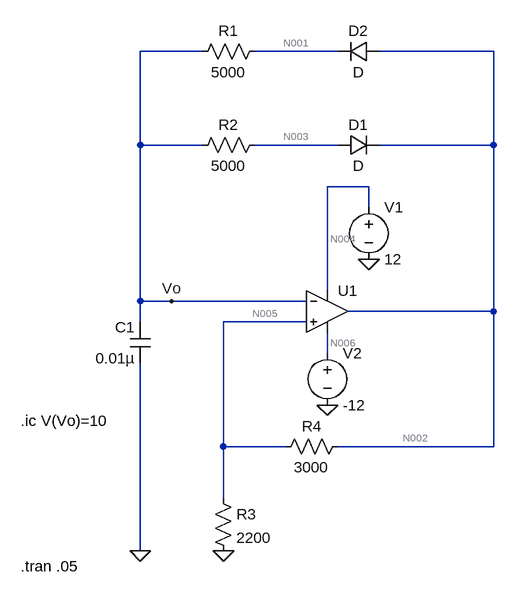
[diagram p0: schematic Draft1.asc]
Draft1.asc, the LTspice schematic file:
Version 4
SHEET 1 880 680
WIRE -16 -272 -112 -272
WIRE 192 -272 64 -272
WIRE 432 -272 256 -272
WIRE -112 -128 -112 -272
WIRE -16 -128 -112 -128
WIRE 192 -128 64 -128
WIRE 432 -128 432 -272
WIRE 432 -128 256 -128
WIRE 240 -64 176 -64
WIRE 240 -32 240 -64
WIRE 176 96 176 -64
WIRE -112 112 -112 -128
WIRE -64 112 -112 112
WIRE 144 112 -64 112
WIRE 432 128 432 -128
WIRE 432 128 208 128
WIRE -112 144 -112 112
WIRE 144 144 16 144
WIRE 176 192 176 160
WIRE 16 336 16 144
WIRE 112 336 16 336
WIRE 432 336 432 128
WIRE 432 336 192 336
WIRE 16 416 16 336
WIRE -112 496 -112 208
FLAG 176 272 0
FLAG 240 48 0
FLAG 16 496 0
FLAG -64 112 Vo
FLAG -112 496 0
SYMBOL Opamps\\UniversalOpamp2 176 128 R0
SYMATTR InstName U1
SYMBOL voltage 240 -48 R0
WINDOW 123 0 0 Left 2
WINDOW 39 0 0 Left 2
SYMATTR InstName V1
SYMATTR Value 12
SYMBOL voltage 176 176 R0
WINDOW 123 0 0 Left 2
WINDOW 39 0 0 Left 2
SYMATTR InstName V2
SYMATTR Value -12
SYMBOL diode 192 -112 R270
WINDOW 0 32 32 VTop 2
WINDOW 3 0 32 VBottom 2
SYMATTR InstName D1
SYMBOL diode 256 -288 R90
WINDOW 0 0 32 VBottom 2
WINDOW 3 32 32 VTop 2
SYMATTR InstName D2
SYMBOL res 80 -288 R90
WINDOW 0 0 56 VBottom 2
WINDOW 3 32 56 VTop 2
SYMATTR InstName R1
SYMATTR Value 5000
SYMBOL res 80 -144 R90
WINDOW 0 0 56 VBottom 2
WINDOW 3 32 56 VTop 2
SYMATTR InstName R2
SYMATTR Value 5000
SYMBOL cap -96 208 R180
WINDOW 0 24 56 Left 2
WINDOW 3 24 8 Left 2
SYMATTR InstName C1
SYMATTR Value 0.01µ
SYMBOL res 0 400 R0
SYMATTR InstName R3
SYMATTR Value 2200
SYMBOL res 208 320 R90
WINDOW 0 0 56 VBottom 2
WINDOW 3 32 56 VTop 2
SYMATTR InstName R4
SYMATTR Value 3000
TEXT -296 296 Left 2 !.ic V(Vo)=10
TEXT -296 520 Left 2 !.tran .05

The netlist it stands for:
* Draft1.asc
XU1 N005 Vo N004 N006 N002 level.2 Avol=1Meg GBW=10Meg Slew=10Meg ilimit=25m rail=0 Vos=0 phimargin=45 en=0 enk=0 in=0 ink=0 Rin=500Meg  ; pins IN+ IN- V+ V- OUT
V1 N004 0 12
V2 N006 0 -12
D1 N003 N002 D
D2 N002 N001 D
R1 N001 Vo 5000
R2 N003 Vo 5000
C1 0 Vo 0.01µ
R3 N005 0 2200
R4 N002 N005 3000
.model D D
.lib standard.dio
.ic V(Vo)=10
.tran .05
.lib UniversalOpamps2.sub
.backanno
.end

* Results of the author's LTspice run, read from the files saved beside the schematic
* Operating Point, zero values left out:
*   V(n002) = -11.93 V
*   V(n004) = 12 V
*   V(n006) = -12 V
*   V(vo) = 10 V
*   V(n005) = -5.046 V
*   V(n003) = -11.23 V
*   V(n001) = 10 V
*   I(D2) = -21.94 pA
*   I(D1) = 4.247 mA
*   I(R4) = -2.294 mA
*   I(R3) = -2.294 mA
*   I(R2) = -4.247 mA
*   I(R1) = -21.94 pA
*   I(V2) = 6.543 mA
*   I(V1) = -2.773 µA
*   Ix(u1:1) = -10.09 nA
*   Ix(u1:2) = 20 nA
*   Ix(u1:3) = 2.773 µA
*   Ix(u1:4) = -6.543 mA
*   Ix(u1:5) = 6.541 mA